# Altium project ARDUINO_MEGA_GIGA_SHIELD_TEMPLATE.PrjPcb
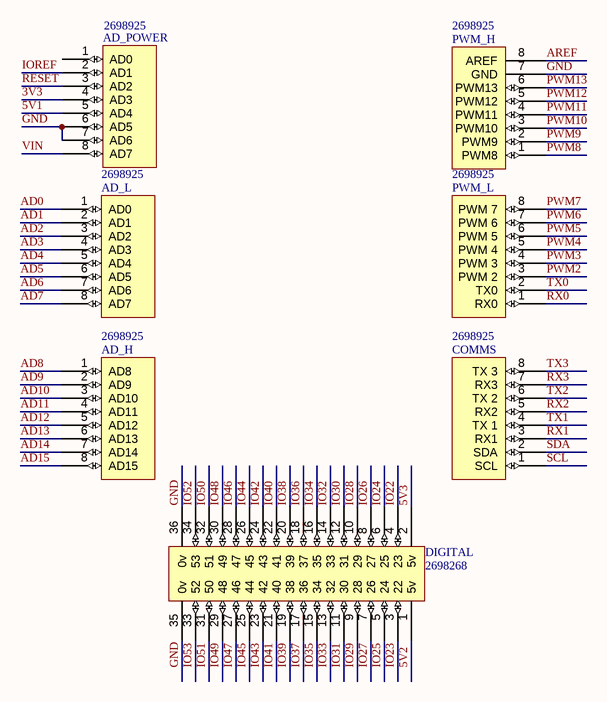
[diagram p0: arduino_mega_giga_shield_template.SchDoc]
TotalSheet: 1
1 sheet, 7 parts. Net scope: global (net labels, ports and power ports of the same name join across sheets).
Board file: arduino_mega_giga_shield_template.pcbdoc

## Sheet arduino_mega_giga_shield_template.SchDoc
size 431 x 279 mm; Document_content: Arduino Giga R1 Shield; VersionRevision: 1; Organization: ORGANIZATION; Address1: ADDRESS 1; Address2: ADDRESS 2; Address3: ADDRESS 3; Address4: ADDRESS 4; Revision: -; SheetNumber: 1; SheetTotal: 1; ENG_APP_DATE: --/--/--; DSN_APP_DATE: --/--/--; CHK_APP_DATE: --/--/--

### Parts
AD_H  Supplier Part Number 4: 2698925  [Header 8x1 8.5mm]  (hidden comment: AD_H)
AD_L  Supplier Part Number 5: 2698925  [Header 8x1 8.5mm]  (hidden comment: AD_L)
AD_POWER  Supplier Part Number 5: 2698925  [Header 8x1 8.5mm]  (hidden comment: AD_POWER)
COMMS  Supplier Part Number 4: 2698925  [Header 8x1 8.5mm]  (hidden comment: Communication)
DIGITAL  Supplier Part Number 5: 2698268  [HEADER 36X 8MM]  (hidden comment: IO_36)
PWM_H  Supplier Part Number 4: 2698925  [Header 8x1 8.5mm]  (hidden comment: PWM_H)
PWM_L  Supplier Part Number 4: 2698925  [Header 8x1 8.5mm]  (hidden comment: PWM_L)

### Nets
3V3: AD_POWER.4(AD3)
5V1: AD_POWER.5(AD4)
5V2: DIGITAL.1(5v)
5V3: DIGITAL.2(5v)
AD0: AD_L.1(AD0)
AD1: AD_L.2(AD1)
AD2: AD_L.3(AD2)
AD3: AD_L.4(AD3)
AD4: AD_L.5(AD4)
AD5: AD_L.6(AD5)
AD6: AD_L.7(AD6)
AD7: AD_L.8(AD7)
AD8: AD_H.1(AD8)
AD9: AD_H.2(AD9)
AD10: AD_H.3(AD10)
AD11: AD_H.4(AD11)
AD12: AD_H.5(AD12)
AD13: AD_H.6(AD13)
AD14: AD_H.7(AD14)
AD15: AD_H.8(AD15)
AREF: PWM_H.8(AREF)
GND: AD_POWER.6(AD5) AD_POWER.7(AD6) DIGITAL.35(0v) DIGITAL.36(0v) PWM_H.7(GND)
IO22: DIGITAL.4(23)
IO23: DIGITAL.3(22)
IO24: DIGITAL.6(25)
IO25: DIGITAL.5(24)
IO26: DIGITAL.8(27)
IO27: DIGITAL.7(26)
IO28: DIGITAL.10(29)
IO29: DIGITAL.9(28)
IO30: DIGITAL.12(31)
IO31: DIGITAL.11(30)
IO32: DIGITAL.14(33)
IO33: DIGITAL.13(32)
IO34: DIGITAL.16(35)
IO35: DIGITAL.15(34)
IO36: DIGITAL.18(37)
IO37: DIGITAL.17(36)
IO38: DIGITAL.20(39)
IO39: DIGITAL.19(38)
IO40: DIGITAL.22(41)
IO41: DIGITAL.21(40)
IO42: DIGITAL.24(43)
IO43: DIGITAL.23(42)
IO44: DIGITAL.26(45)
IO45: DIGITAL.25(44)
IO46: DIGITAL.28(47)
IO47: DIGITAL.27(46)
IO48: DIGITAL.30(49)
IO49: DIGITAL.29(48)
IO50: DIGITAL.32(51)
IO51: DIGITAL.31(50)
IO52: DIGITAL.34(53)
IO53: DIGITAL.33(52)
IOREF: AD_POWER.2(AD1)
PWM2: PWM_L.3(PWM_2)
PWM3: PWM_L.4(PWM_3)
PWM4: PWM_L.5(PWM_4)
PWM5: PWM_L.6(PWM_5)
PWM6: PWM_L.7(PWM_6)
PWM7: PWM_L.8(PWM_7)
PWM8: PWM_H.1(PWM8)
PWM9: PWM_H.2(PWM9)
PWM10: PWM_H.3(PWM10)
PWM11: PWM_H.4(PWM11)
PWM12: PWM_H.5(PWM12)
PWM13: PWM_H.6(PWM13)
RESET: AD_POWER.3(AD2)
RX0: PWM_L.1(RX0)
RX1: COMMS.3(RX1)
RX2: COMMS.5(RX2)
RX3: COMMS.7(RX3)
SCL: COMMS.1(SCL)
SDA: COMMS.2(SDA)
TX0: PWM_L.2(TX0)
TX1: COMMS.4(TX_1)
TX2: COMMS.6(TX_2)
TX3: COMMS.8(TX_3)
VIN: AD_POWER.8(AD7)

Not connected (* = marked no-connect by the designer): AD_POWER 1(AD0)

### Notes on the sheet
- DWG. NO.
- REV.
- SHT.
- THIS DOCUMENT AND THE DATA DISCLOSED HEREIN OR HEREWITH IS THE PROPERTY OF ALTIUM LIMITED AND MAY BE FREELY DISTRIBUTED IN WHOLE. NO RIGHTS ARE RESERVED OR EXPRESS OR IMPLIED WARANTEE GIVEN.
- REVISION
- DESCRIPTION
- DATE
- APPROVED
- ENG:
- APPROVALS
- PROJECT
- DSN:
- CHK:
- REFERENCE DOCUMENTS
- PROJECT REVISION:
- TITLE
- DOCUMENT REVISION:
- DESIGN ITEM:
- BOM:
- FAB DWG:
- PCB DWG:
- ASSY DWG:
- SCALE:
- SIZE
- B
- CAGE CODE
- FILE NAME
- DWG NO.
- SHEET
- OF
- REV

### Library data of the parts
AD_POWER = AD_L: Supplier 1: Digi-Key; Supplier Part Number 1: SAM1198-08-ND; Supplier 2: Arrow; Supplier Part Number 2: 2698939; Supplier 3: Arrow; Supplier Part Number 3: 2698940; Supplier 4: Arrow; Supplier Part Number 4: 43085273; Supplier 5: Arrow
AD_H = AD_H: Supplier 1: Arrow; Supplier Part Number 1: 2698940; Supplier 2: Arrow; Supplier Part Number 2: 2698939; Supplier 3: Digi-Key; Supplier Part Number 3: SAM1198-08-ND; Supplier 4: Arrow
AD_L = AD_L: Supplier 1: Digi-Key; Supplier Part Number 1: SAM1198-08-ND; Supplier 2: Arrow; Supplier Part Number 2: 2698939; Supplier 3: Arrow; Supplier Part Number 3: 2698940; Supplier 4: Arrow; Supplier Part Number 4: 43085273; Supplier 5: Arrow
COMMS = Communication: Supplier 1: Digi-Key; Supplier Part Number 1: SAM1198-08-ND; Supplier 2: Arrow; Supplier Part Number 2: 2698940; Supplier 3: Arrow; Supplier Part Number 3: 2698939; Supplier 4: Arrow
DIGITAL = IO_36: Supplier 1: Digi-Key; Supplier Part Number 1: SAM1196-18-ND; Supplier 2: Arrow; Supplier Part Number 2: 48117090; Supplier 3: Arrow; Supplier Part Number 3: 46093326; Supplier 4: Arrow; Supplier Part Number 4: 2698278; Supplier 5: Arrow
PWM_H = PWM_H: Supplier 1: Digi-Key; Supplier Part Number 1: SAM1198-08-ND; Supplier 2: Arrow; Supplier Part Number 2: 2698940; Supplier 3: Arrow; Supplier Part Number 3: 2698939; Supplier 4: Arrow
PWM_L = PWM_L: Supplier 1: Arrow; Supplier Part Number 1: 2698940; Supplier 2: Arrow; Supplier Part Number 2: 2698939; Supplier 3: Digi-Key; Supplier Part Number 3: SAM1198-08-ND; Supplier 4: Arrow